# Altium project mixed_audio_board.PrjPcb (part 2 of 2)
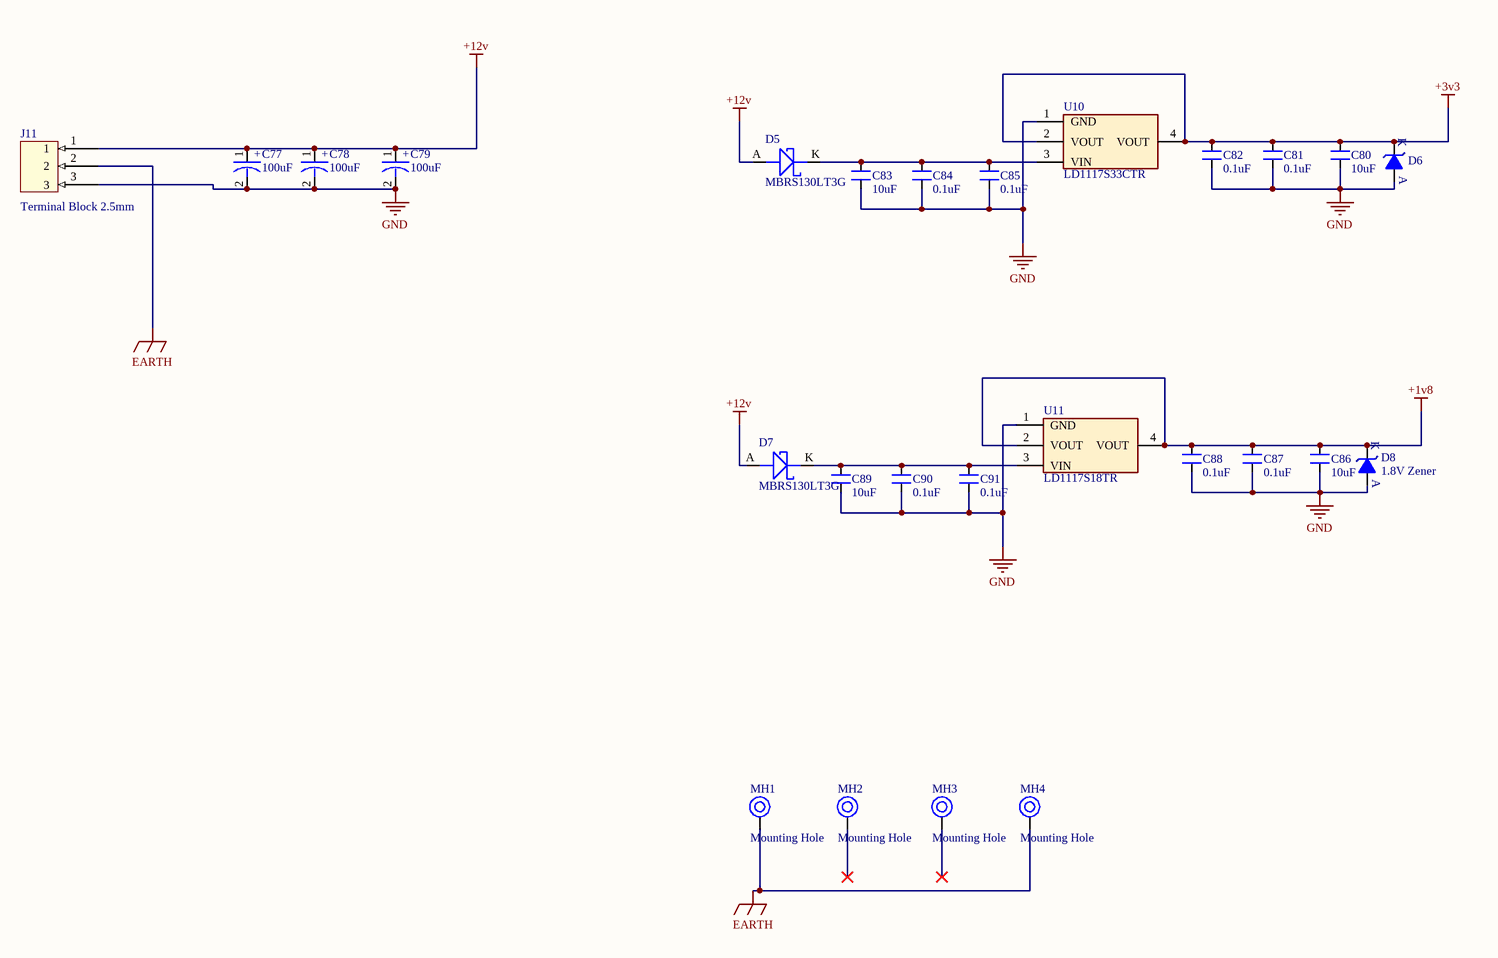
[diagram p21: [11]power_input_and_regualtors.SchDoc]

## Nets that join several sheets
+1v8: [7]DAC_and_MIC (C31.2 C32.2 FB3.2 U5.34), [11]power_input_and_regualtors (6 pins)
+3v3: [3]STM32F103_Debugger (14 pins), [4]Ethernet_PHY (10 pins), [5]Motor_Driver (R21.2), [6]CH340C (C92.2 U4.4 U4.16), [7]DAC_and_MIC (12 pins), [8]ADC_chip (8 pins), [9]STM32F407_Controller (20 pins), [10]Motor_Driver_2 (R45.2), [11]power_input_and_regualtors (6 pins)
+12v: [5]Motor_Driver (7 pins), [10]Motor_Driver_2 (6 pins), [11]power_input_and_regualtors (6 pins)
EARTH: [4]Ethernet_PHY (C23.1 R11.1), [11]power_input_and_regualtors (J11.2 MH1.1 MH4.1)
GND: [3]STM32F103_Debugger (19 pins), [4]Ethernet_PHY (20 pins), [5]Motor_Driver (12 pins), [6]CH340C (C92.1 J5.5 J5.6 U4.1), [7]DAC_and_MIC (25 pins), [8]ADC_chip (10 pins), [9]STM32F407_Controller (28 pins), [10]Motor_Driver_2 (11 pins), [11]power_input_and_regualtors (20 pins)
COL: [4]Ethernet_PHY (DS2.A U2.28), [9]STM32F407_Controller (U8.26)
CRS: [4]Ethernet_PHY (DS1.A U2.29), [9]STM32F407_Controller (U8.23)
NetR9_1: [4]Ethernet_PHY (R9.1 U2.11), [9]STM32F407_Controller (U8.25)
NetR23_1: [5]Motor_Driver (R23.1 U3.14), [9]STM32F407_Controller (U8.45)
NetR28_1: [7]DAC_and_MIC (U5.1), [8]ADC_chip (R28.1 U7.15), [9]STM32F407_Controller (U8.93)
NetR29_1: [7]DAC_and_MIC (U5.2), [8]ADC_chip (R29.1 U7.16), [9]STM32F407_Controller (U8.92)
NetR30_1: [8]ADC_chip (R30.1 U7.3), [9]STM32F407_Controller (U8.55)
NetR47_1: [9]STM32F407_Controller (U8.66), [10]Motor_Driver_2 (R47.1 U9.14)
NetU1_18: [3]STM32F103_Debugger (U1.18), [9]STM32F407_Controller (U8.76)
NetU1_25: [3]STM32F103_Debugger (U1.25 U1.27), [9]STM32F407_Controller (U8.72)
NetU2_12: [4]Ethernet_PHY (U2.12), [9]STM32F407_Controller (U8.16)
NetU2_13: [4]Ethernet_PHY (U2.13), [9]STM32F407_Controller (U8.36)
NetU2_14: [4]Ethernet_PHY (U2.14), [9]STM32F407_Controller (U8.35)
NetU2_15: [4]Ethernet_PHY (U2.15), [9]STM32F407_Controller (U8.34)
NetU2_16: [4]Ethernet_PHY (U2.16), [9]STM32F407_Controller (U8.33)
NetU2_18: [4]Ethernet_PHY (U2.18), [9]STM32F407_Controller (U8.32)
NetU2_19: [4]Ethernet_PHY (U2.19), [9]STM32F407_Controller (U8.24)
NetU2_20: [4]Ethernet_PHY (U2.20), [9]STM32F407_Controller (U8.47)
NetU2_22: [4]Ethernet_PHY (U2.22), [9]STM32F407_Controller (U8.18)
NetU2_23: [4]Ethernet_PHY (U2.23), [9]STM32F407_Controller (U8.48)
NetU2_24: [4]Ethernet_PHY (U2.24), [9]STM32F407_Controller (U8.52)
NetU2_25: [4]Ethernet_PHY (U2.25), [9]STM32F407_Controller (U8.51)
NetU2_26: [4]Ethernet_PHY (U2.26), [9]STM32F407_Controller (U8.17)
NetU2_27: [4]Ethernet_PHY (U2.27), [9]STM32F407_Controller (U8.1)
NetU3_15: [5]Motor_Driver (U3.15), [9]STM32F407_Controller (U8.63)
NetU4_2: [6]CH340C (U4.2), [9]STM32F407_Controller (U8.79)
NetU4_3: [6]CH340C (U4.3), [9]STM32F407_Controller (U8.78)
NetU4_14: [6]CH340C (U4.14), [9]STM32F407_Controller (U8.57)
NetU5_37: [7]DAC_and_MIC (U5.37), [9]STM32F407_Controller (U8.29)
NetU5_38: [7]DAC_and_MIC (U5.38), [9]STM32F407_Controller (U8.89)
NetU5_39: [7]DAC_and_MIC (U5.39), [9]STM32F407_Controller (U8.80)
NetU5_40: [7]DAC_and_MIC (U5.40), [9]STM32F407_Controller (U8.90)
NetU6_3: [7]DAC_and_MIC (U6.3), [9]STM32F407_Controller (U8.65)
NetU6_4: [7]DAC_and_MIC (U6.4), [9]STM32F407_Controller (U8.53)
NetU7_14: [8]ADC_chip (U7.14), [9]STM32F407_Controller (U8.56)
NetU8_31: [9]STM32F407_Controller (U8.31), [10]Motor_Driver_2 (U9.11)
NetU8_60: [9]STM32F407_Controller (U8.60), [10]Motor_Driver_2 (U9.15)
nFAULT: [5]Motor_Driver (R20.1 U3.9), [9]STM32F407_Controller (U8.62)
nFAULT_2: [9]STM32F407_Controller (U8.59), [10]Motor_Driver_2 (R44.1 U9.9)
NRST: [3]STM32F103_Debugger (U1.26), [9]STM32F407_Controller (C54.2 R33.1 SW3.2 U8.14)
PHY_RESET: [4]Ethernet_PHY (R4.1 SW2.2 U2.32), [9]STM32F407_Controller (U8.64)
RESET_DAC: [7]DAC_and_MIC (R26.2 U5.32), [9]STM32F407_Controller (U8.54)
SNSO: [5]Motor_Driver (R22.1 U3.10), [9]STM32F407_Controller (U8.61)
SNSO_2: [9]STM32F407_Controller (U8.58), [10]Motor_Driver_2 (R46.1 U9.10)
SO: [5]Motor_Driver (U3.11), [9]STM32F407_Controller (U8.30)